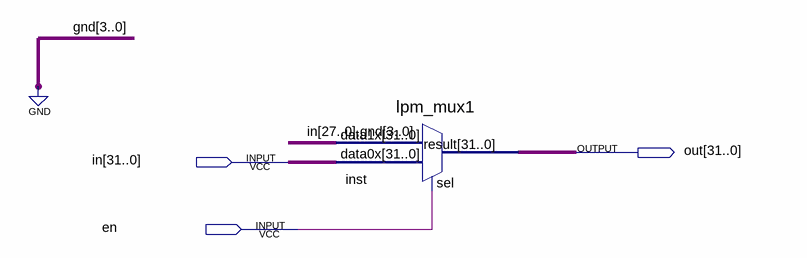
[diagram p0: schematic sheet]
// Quartus schematic shift_left_4bit.bdf as structural Verilog: 1 symbols, 3 pins
module shift_left_4bit (
  input  [31:0] in,
  input  en,
  output [31:0] out
);

  lpm_mux1 inst (.data1x({in[27:0], 4'b0000}), .data0x(in), .sel(en), .result(out));
endmodule
